# Altium schematic sheet Power.SchDoc
size A4; SheetNumber: 2; SheetTotal: 5; SPICEModelCacheCJZDPLED: <root> / <DocumentId>CJZDPLED</DocumentId> / </root>
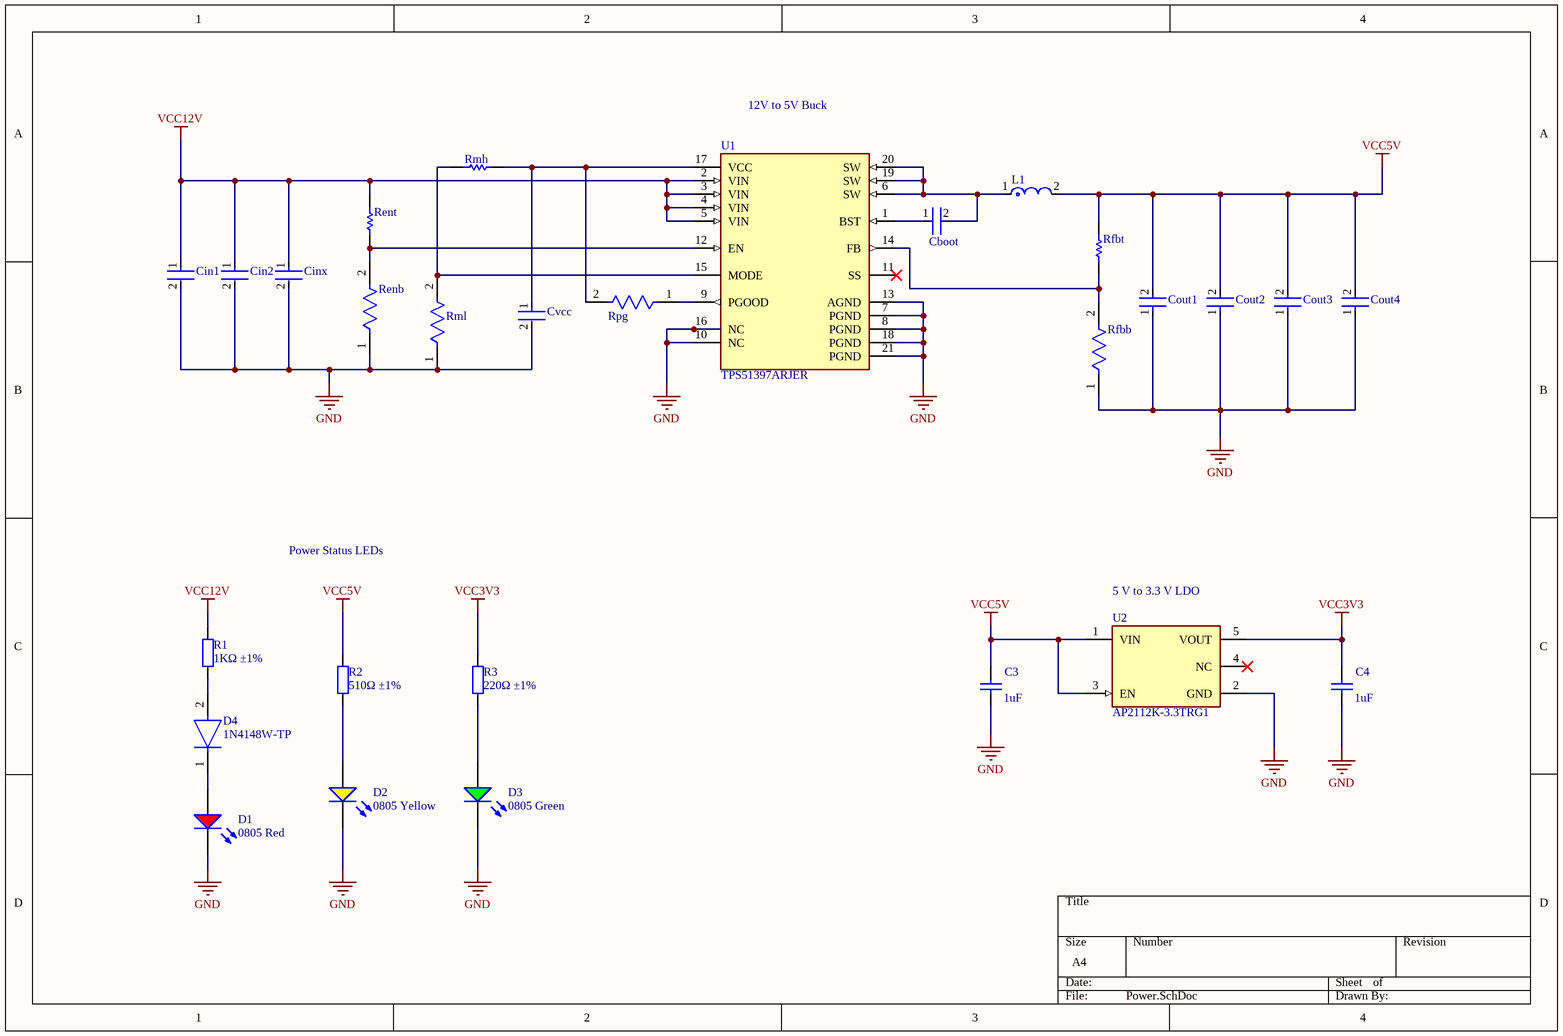
[diagram p0: Power.SchDoc]

## Parts
C3  1uF  [0805_C]
C4  1uF  [0805_C]
Cboot  GRM155R71C104KA88D  [FP-GRM15-MFG]  (value not drawn)
Cin1  C2012X5R1V226M125AC  [FP-C2012-125-0_2-MFG]  (value not drawn)
Cin2  C2012X5R1V226M125AC  [FP-C2012-125-0_2-MFG]  (value not drawn)
Cinx  CGA3E2X7R1H104K080AA  [FP-CGA3E-0_3-0_1-IPC_A]  (value not drawn)
Cout1  GRM31CR61A476KE15K  [FP-GRM31C-0_2-e0_3_0_8-IPC_A]  (value not drawn)
Cout2  GRM31CR61A476KE15K  [FP-GRM31C-0_2-e0_3_0_8-IPC_A]  (value not drawn)
Cout3  GRM31CR61A476KE15K  [FP-GRM31C-0_2-e0_3_0_8-IPC_A]  (value not drawn)
Cout4  GRM31CR61A476KE15K  [FP-GRM31C-0_2-e0_3_0_8-IPC_A]  (value not drawn)
Cvcc  EMK107B7105KA-T  [FP-0603-L_1_6_0_1-W_0_8_0-IPC_C]  (value not drawn)
D1  0805 Red  [0805_LED_S1]
D2  0805 Yellow  [0805_LED_S1]
D3  0805 Green  [0805_LED_S1]
D4  1N4148W-TP  [FP-SOD-123-IPC_A]
L1  XAL7070-182MEC  [FP-XAL7070-MFG]  (value not drawn)
R1  1KΩ ±1%  [0603_R]
R2  510Ω ±1%  [0603_R]
R3  220Ω ±1%  [0603_R]
Renb  CRCW040251K1FKED  [FP-CRCW0402-e3-MFG]  (value not drawn)
Rent  CRCW0402221KFKED  [RESC1005X40X25ML05T05]  (value not drawn)
Rfbb  CRCW040215K0FKED  [FP-CRCW0402-e3-IPC_B]  (value not drawn)
Rfbt  CRCW0402110KFKED  [RESC1005X40X25NL05T05]  (value not drawn)
Rmh  330K 1% 0603(1608)  [RESC0603(1608)_M]  (value not drawn)
Rml  CRCW040215K0FKED  [FP-CRCW0402-e3-IPC_B]  (value not drawn)
Rpg  CRCW0402100KFKEDC  [FP-CRCW0402-C-e3-MFG]  (value not drawn)
U1  TPS51397ARJER  [FP-RJE0020B-MFG]
U2  AP2112K-3.3TRG1  [FP-SOT25-IPC_A]

## Nets
GND: C3.1 C4.1 Cin1.2 Cin2.2 Cinx.2 Cout1.1 Cout2.1 Cout3.1 Cout4.1 Cvcc.2 D1.K D2.K D3.K Renb.1 Rfbb.1 Rml.1 U1.7(PGND) U1.8(PGND) U1.10(NC) U1.13(AGND) U1.16(NC) U1.18(PGND) U1.21(PGND) U2.2(GND)
VCC3V3: C4.2 R3.2 U2.5(VOUT)
VCC5V: C3.2 Cout1.2 Cout2.2 Cout3.2 Cout4.2 L1.2 R2.2 Rfbt.2 U2.1(VIN) U2.3(EN)
VCC12V: Cin1.1 Cin2.1 Cinx.1 R1.2 Rent.2 U1.2(VIN) U1.3(VIN) U1.4(VIN) U1.5(VIN)
NetCboot_1: Cboot.1 U1.1(BST)
NetCboot_2: Cboot.2 L1.1 U1.6(SW) U1.19(SW) U1.20(SW)
NetCvcc_1: Cvcc.1 Rmh.1 Rpg.2 U1.17(VCC)
NetD1_A: D1.A D4.1(C)
NetD2_A: D2.A R2.1
NetD3_A: D3.A R3.1
NetD4_2: D4.2(A) R1.1
NetRenb_2: Renb.2 Rent.1 U1.12(EN)
NetRfbb_2: Rfbb.2 Rfbt.1 U1.14(FB)
NetRmh_2: Rmh.2 Rml.2 U1.15(MODE)
NetRpg_1: Rpg.1 U1.9(PGOOD)

Not connected (* = marked no-connect by the designer): U1 11(SS)*; U2 4(NC)*

## Notes on the sheet
- 12V to 5V Buck
- Power Status LEDs
- (near U2) 5 V to 3.3 V LDO

## Library data of the parts
C3 C4 = 0805 1uF (105) 10% 50V: Chip capacitors; Manufacturer: Samsung Electro-Mechanics; PartNumber: CL21B105KBFNNNE; Tolerance: 10%; Voltage: 50V; ComponentLink1Description: Supplier link; ComponentLink1URL: http://www.szlcsc.com/product/details_29074.html; Package: 0805; Supplier: LC; SuppliersPartNumber: C28323; Capacitance: 1uF
Cboot = CMP-2100-03641-2: CAP CER 0.1UF 16V X7R 0402; Manufacturer: Murata; Standoff Height: 0mm; Tolerance: 10%; Voltage Rating: 16Vdc; Capacitance: 0.10μF; Value: 0.10μF; RoHS: TRUE; Manufacturer Part Number: GRM155R71C104KA88D; Temperature Characteristic: X7R; Octopart: https://octopart.com/grm155r71c104ka88d-murata-196880; Digikey Description: CAP CER 0.1UF 16V X7R 0402; Device Class L3: Ceramic Capacitors; Height: 0.55mm; ComponentLink2Description: Datasheet; Temperature Range Low: -55°C; Ipc Land Pattern Name: CAPC10050X219; ComponentLink2URL: https://search.murata.co.jp/Ceramy/image/img/A01X/G101/ENG/GRM155R71H471KA01-01A.pdf; Device Class L1: Passive Components; Lead Free: yes; Category: Cap; Package: GRM15; Temperature: -55°C to +125°C; Device Class L2: Capacitors; Material: Ceramic; Temperature Range High: +125°C; Mouser Description: 0402 0.1 uF 16V ±10 % Tolerance X7R SMT Multilayer Ceramic Capacitor
Cin1 Cin2 = CMP-2000-06038-3: Multilayer Ceramic Capacitors 22μF ±20% 35V X5R SMD 0805; Capacitance: 22uF; Tolerance: 20%; RoHS Compliant: Yes; Height: 1.25mm; Termination: SMD/SMT; Case/Package: 0805; Thickness: 0.057inch; Max Operating Temperature: 85°C; Min Operating Temperature: -55°C; Voltage Rating (DC): 35V; Length: 0.079inch; Dielectric: X5R; Dielectric Material: Ceramic; Voltage Rating: 35V; Mount: Surface Mount; Package Quantity: 2000; Lead Free: Lead Free; Weight: 0.000194oz; REACH SVHC: No SVHC; Width: 0.049inch; Packaging: Tape and Reel; Series: C; Case Code (Metric): 2012; Case Code (Imperial): 0805
Cinx = CMP-2000-07546-2: Cap Ceramic 100nF 50V X7R 10% Pad SMD 0603 +125°C Automotive T/R; Weight: 7.1E-05oz; Composition: Ceramic; Max Operating Temperature: 125°C; Termination: SMD/SMT; Dielectric: X7R; Length: 1.6mm; Package Quantity: 1; REACH SVHC: No SVHC; Lead Free: Lead Free; Case Code (Metric): 1608; Min Operating Temperature: -55°C; Packaging: Tape and Reel; Tolerance: 10%; Voltage Rating: 50V; Case Code (Imperial): 0603; Capacitance: 100nF; Case/Package: 0603; Voltage Rating (DC): 50V; Depth: 0.8mm; Radiation Hardening: No; Ratings: AEC-Q200; Mount: Surface Mount; Voltage: 50V; Thickness: 0.035inch; Width: 0.8mm; Height: 0.8mm
Cout1-Cout4 = CMP-06035-007919-1: Chip Multilayer Ceramic Capacitors for General Purpose, 1206, 47uF, X5R, 15%, 10%, 10V; Width: 0.063inch; Thickness: 0.071inch; Max Operating Temperature: 85°C; Min Operating Temperature: -55°C; Length: 3.2mm; Case Code (Metric): 3216; Resistor Type: Ceramic; Packaging: Tape and Reel; Weight: 0.001411oz; Case Code (Imperial): 1206; Mount: Surface Mount; Depth: 1.6mm; Capacitance: 47uF; Package Quantity: 6000; Height: 1.6mm; Case/Package: 1206; Tolerance: 10%; Dielectric: X5R; Voltage Rating: 10V; Voltage Rating (DC): 10V; Termination: SMD/SMT
Cvcc = CMP-14477-000018-3: None; Voltage Rating (DC): 16V; Dielectric: X7R; Capacitance: 1uF; Tolerance: 10%; Halogen Free: Halogen Free; Height: 0.8mm; REACH SVHC: No SVHC; Contact Plating: Nickel; Number of Pins: 2; Resistor Type: Ceramic; Series: M; Thickness: 0.035inch; Construction: Flat; Voltage Rating: 16V; Packaging: Tape and Reel; Width: 0.031inch; Length: 1.6mm; Case Code (Metric): 1608; RoHS Compliant: Yes; Termination: SMD/SMT; Min Operating Temperature: -55°C; Case/Package: 0603; Mount: Surface Mount; Case Code (Imperial): 0603; Depth: 0.8mm; Package Quantity: 1; Max Operating Temperature: 125°C; Lead Free: Lead Free; Radiation Hardening: No
D1 = 0805 LED Red: LED; PartNumber: FC-2012HRK-620D; Manufacturer: Foshan NationStar Optoelectronics; ComponentLink1Description: 供应商链接; ComponentLink1URL: http://www.szlcsc.com/product/details_2668.html; Package: 0805; Supplier: LC; SuppliersPartNumber: C84256; Color: Red
D2 = 0805 LED Yellow: LED; PartNumber: 17-21SUYC/TR8; ComponentLink1Description: 供应商链接; ComponentLink1URL: http://www.szlcsc.com/product/details_2669.html; Package: 0805; Supplier: LC; SuppliersPartNumber: C2296; Color: Yellow
D3 = 0805 LED Green: LED; ComponentLink1Description: 供应商链接; ComponentLink1URL: http://www.szlcsc.com/product/details_2670.html; Package: 0805; Supplier: LC; SuppliersPartNumber: C2297; Color: Green
D4 = CMP-2000-04993-2: DIODE GEN PURP 100V 150MA SOD123; Max Reverse Leakage Current: 5uA; Max Surge Current: 2A; Reverse Recovery Time: 4ns; Polarity: Standard; Capacitance: 4pF; Max Forward Surge Current (Ifsm): 1A; Element Configuration: Single; Power Dissipation: 400mW; Forward Voltage: 1V; Radiation Hardening: No; Lead Free: Lead Free; Max Reverse Voltage (DC): 100V; Current Rating: 150mA; Forward Current: 150mA; Packaging: Tape and Reel; Number of Pins: 2; Package Quantity: 3000; Max Operating Temperature: 150°C; Min Operating Temperature: -65°C; Average Rectified Current: 150mA; Recovery Time: 4ns; Output Current: 150mA; Peak Non-Repetitive Surge Current: 2A; Width: 1.8mm; Voltage Rating (DC): 100V; Height: 1.2mm; Max Repetitive Reverse Voltage (Vrrm): 100V; Mount: Surface Mount; Length: 2.85mm
L1 = CMP-11268-000116-1: Surface Mount Power Inductor, 1.8 H, 21 A, 25 A, Shielded, 4460 ohm; RMS Current (Irms): 21A; Self Resonant Frequency: 43MHz; Inductance Tolerance: 20%; Inductance: 1.8uH; DC Resistance (DCR): 4.46mR; Test Frequency: 100kHz; Core Material: Composite; Saturation Current: 25A; Length: 8mm; Lead Free: Contains Lead; Height: 7mm; REACH SVHC: No SVHC; Max Operating Temperature: 125°C; Width: 7.7mm; Termination: SMD/SMT; Mount: Surface Mount; Packaging: Tape and Reel; Shielding: Shielded; Case/Package: SMD/SMT; RoHS Compliant: Yes; Package Quantity: 150; Tolerance: 20%; Min Operating Temperature: -40°C; Series: XAL7070; Max DC Current: 21A
R1 = 0603 1K (1001) 1%: Chip resistor; Manufacturer: Uniroyal Elec; PartNumber: 0603WAF1001T5E; Power: 1/10W; ComponentLink1Description: Supplier link; ComponentLink1URL: http://www.szlcsc.com/product/details_21904.html; Package: 0603; Supplier: LC; SuppliersPartNumber: C21190; Resistance: 1KΩ; Tolerance: 1%
R2 = 0603 510R (5100) 1%: Chip resistor; Manufacturer: Uniroyal Elec; PartNumber: 0603WAF5100T5E; Power: 1/10W; ComponentLink1Description: Supplier link; ComponentLink1URL: http://www.szlcsc.com/product/details_23920.html; Package: 0603; Supplier: LC; SuppliersPartNumber: C23193; Resistance: 510Ω; Tolerance: 1%
R3 = 0603 220R (2200) 1%: Chip resistor; Manufacturer: Uniroyal Elec; PartNumber: 0603WAF2200T5E; Power: 1/10W; ComponentLink1Description: Supplier link; ComponentLink1URL: http://www.szlcsc.com/product/details_23689.html; Package: 0603; Supplier: LC; SuppliersPartNumber: C22962; Resistance: 220Ω; Tolerance: 1%
Renb = CMP-2002-00080-2: RES Thick Film, 51.1kΩ, 1%, 0.063W, 100ppm/°C, 0402; Voltage Rating (DC): 50V; Max Power Dissipation: 63mW; Resistance: 51.1kR; Case Code (Imperial): 0402; Tolerance: 1%; Width: 0.5mm; Case Code (Metric): 1005; Termination: SMD/SMT; Features: Automotive AEC-Q200; Composition: Thick Film; Package Quantity: 10; Max Operating Temperature: 155°C; Number of Pins: 2; Weight: 2.3E-05oz; Temperature Coefficient: 100ppm/°C; Radiation Hardening: No; Case/Package: 0402; Length: 1mm; Contact Plating: Tin; Depth: 0.5mm; Height: 0.35mm; Packaging: Tape and Reel; Military Standard: Not; Mount: Surface Mount; Min Operating Temperature: -55°C; Number of Terminations: 2; Power Rating: 63mW; Lead Free: Lead Free; Voltage Rating: 50V
Rent = CMP-2002-08374-1: Manufacturer: Vishay Dale; Part Number: CRCW0402221KFKED
Rfbb Rml = CMP-2002-08219-2: RES Thick Film, 15kΩ, 1%, 0.063W, 100ppm/°C, 0402; Voltage Rating: 50V; Power Rating: 63mW; Resistance: 15kR; Weight: 2.3E-05oz; Length: 1mm; Temperature Coefficient: 100ppm/°C; Min Operating Temperature: -55°C; Mount: Surface Mount; Termination: SMD/SMT; Working Voltage: 50V; Voltage Rating (DC): 50V; Width: 0.02inch; Case Code (Metric): 1005; Max Operating Temperature: 155°C; Contact Plating: Tin; Case/Package: 0402; Composition: Thick Film; Tolerance: 1%; Number of Terminations: 2; Height: 0.35mm; Case Code (Imperial): 0402; Max Power Dissipation: 63mW; Features: Automotive AEC-Q200; Depth: 0.5mm; Military Standard: Not; Radiation Hardening: No; Packaging: Tape and Reel; Package Quantity: 10; Lead Free: Lead Free
Rfbt = CMP-2002-08148-1: Manufacturer: Vishay Dale; Part Number: CRCW0402110KFKED
Rmh = CMP-1012-00793-1: 330K 0.1W 1% 0603 (1608 Metric)  SMD; Case-EIA: 0603; Case-Metric: 1608; Value: 330000.00 Ohm; Power: 0.1 W; Technology: SMT; Tolerance: 1 %
Rpg = CMP-02407-010951-1: RES 100K OHM 1% 1/16W 0402; Temperature Coefficient: 100ppm/°C; Power Rating: 62.5mW; Resistance: 100kR; Lead Free: Lead Free; Length: 1mm; Tolerance: 1%; Resistor Type: Thick Film; Contact Plating: Tin; Case/Package: SMD/SMT; Min Operating Temperature: -55°C; RoHS Compliant: Yes; Termination: Wraparound; Max Operating Temperature: 155°C; Mount: Surface Mount
U1 = CMP-04918-000702-1: 10-A SYNCHRONOUS STEP-DOWN REGUL
U2 = CMP-12756-000035-1: IC REG LINEAR 3.3V 600MA SOT25; Number of Regulators: 1; Output Type: Fixed; Polarity: Positive; Min Input Voltage: 2.5V; Max Input Voltage: 6V; Accuracy: 1.5%; Quiescent Current: 55uA; Dropout Voltage: 250mV; Min Operating Temperature: -40°C; Length: 3.1mm; Output Current: 600mA; Max Operating Temperature: 85°C; Package Quantity: 1; Output Voltage: 3.3V; Width: 1.7mm; Number of Outputs: 1; Packaging: Tape and Reel; Height: 1.3mm; Lead Free: Lead Free; Max Output Current: 600mA; Case/Package: SOT-23-5; Mount: Surface Mount; Number of Pins: 5